# Altium schematic sheet MicroDial_Data_Log_V2_Part4.SchDoc: MicroDial_Data_Log_V2
size A4; Author: Burak DURU; Organization: CNRS DT INSU UPS855; Address1: 1, place Aristide Briand; Address2: 92195 Meudon Cedex; Address3: Tel : 01 45 07 50 50; Address4: FRANCE; DocumentNumber: 4; Revision: 2.0; SheetNumber: 4; SheetTotal: 4
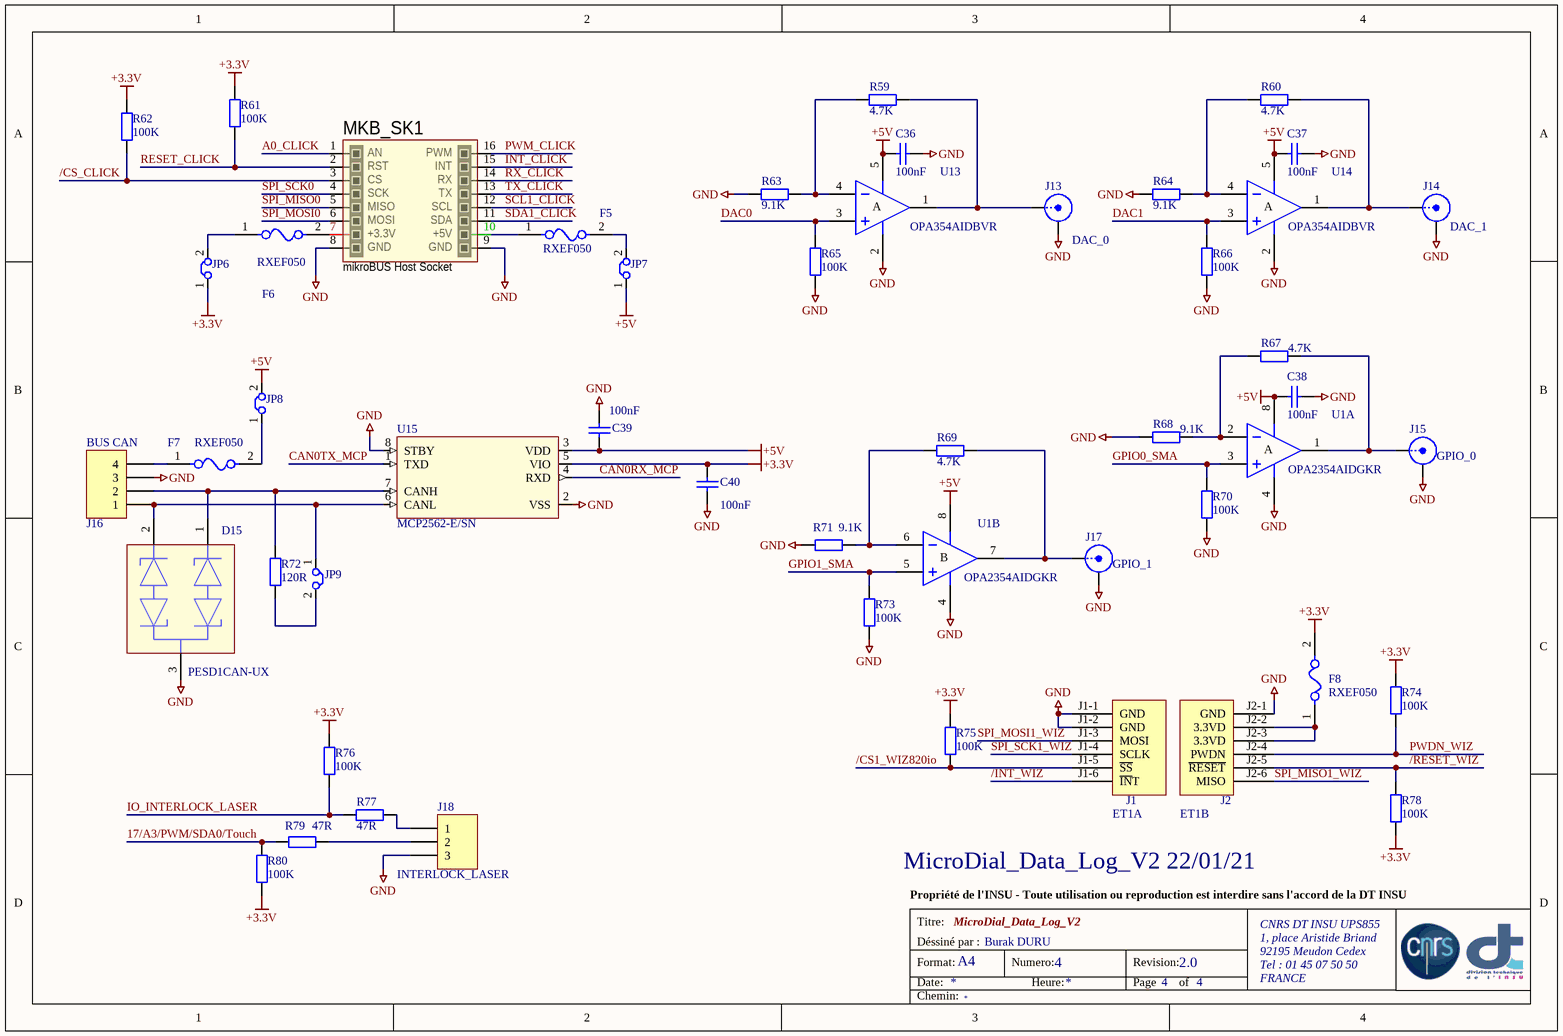
[diagram p0: MicroDial_Data_Log_V2_Part4.SchDoc]

## Parts
C36  value 100nF  [C603]  (hidden comment: Capacitor CMS)
C37  value 100nF  [C603]  (hidden comment: Capacitor CMS)
C38  value 100nF  [C603]  (hidden comment: Capacitor CMS)
C39  value 100nF  [C603]  (hidden comment: Capacitor CMS)
C40  value 100nF  [C603]  (hidden comment: Capacitor CMS)
D15  PESD1CAN-UX  [SOT323 (SC70) - PESD1CAN-UX]
ET1  Module ETHERNET WIZNET WIZ820IO  [WIZ820io-V1.0]  (value not drawn)  (parts A,B of 2)
F5  RXEF050  [FP-RXEF050-MFG]
F6  RXEF050  [FP-RXEF050-MFG]
F7  RXEF050  [FP-RXEF050-MFG]
F8  RXEF050  [FP-RXEF050-MFG]
J13  DAC_0  [SMB125B1]
J14  DAC_1  [SMB125B1]
J15  GPIO_0  [SMA R125.680.000]
J16  BUS CAN  [PHOENIX CONTACT MC 1,5/ 4-G-3,81 - 1803293]
J17  GPIO_1  [SMA R125.680.000]
J18  INTERLOCK_LASER  [Molex 90136-2203 - UPDATE]
JP6  Cavalier 1 Positions 1-2  [Molex 90120-0762]  (value not drawn)
JP7  Cavalier 1 Positions 1-2  [Molex 90120-0762]  (value not drawn)
JP8  Cavalier 1 Positions 1-2  [Molex 90120-0762]  (value not drawn)
JP9  Cavalier 1 Positions 1-2  [Molex 90120-0762]  (value not drawn)
MKB_SK1  mikroBUS Host Socket  [mikroBUS Host Socket]
R59  value 4.7K  [MMA204]  (hidden comment: Res)
R60  value 4.7K  [MMA204]  (hidden comment: Res)
R61  value 100K  [R603]  (hidden comment: Res)
R62  value 100K  [R603]  (hidden comment: Res)
R63  value 9.1K  [MMA204]  (hidden comment: Res)
R64  value 9.1K  [MMA204]  (hidden comment: Res)
R65  value 100K  [R603]  (hidden comment: Res)
R66  value 100K  [R603]  (hidden comment: Res)
R67  value 4.7K  [MMA204]  (hidden comment: Res)
R68  value 9.1K  [MMA204]  (hidden comment: Res)
R69  value 4.7K  [MMA204]  (hidden comment: Res)
R70  value 100K  [R603]  (hidden comment: Res)
R71  value 9.1K  [MMA204]  (hidden comment: Res)
R72  value 120R  [R603]  (hidden comment: Res)
R73  value 100K  [R603]  (hidden comment: Res)
R74  value 100K  [R603]  (hidden comment: Res)
R75  value 100K  [R603]  (hidden comment: Res)
R76  value 100K  [R603]  (hidden comment: Res)
R77  value 47R  [R603]  (hidden comment: Res)
R78  value 100K  [R603]  (hidden comment: Res)
R79  value 47R  [R603]  (hidden comment: Res)
R80  value 100K  [R603]  (hidden comment: Res)
U1  OPA2354AIDGKR  [VSSOP-8 (DGK(S-PDSO-G8))]  (parts A,B of 2)
U13  OPA354AIDBVR  [SOT23-5]
U14  OPA354AIDBVR  [SOT23-5]
U15  MCP2562-E/SN  [SOIC8N (Narrow) - MCP2562-E]

## Nets
+3.3V: C40.1 F8.2 JP6.1 R61.2 R62.2 R74.2 R75.2 R76.2 R78.2 R80.1 U15.5(VIO)
+5V: C36.1 C37.1 C38.1 C39.1 JP7.1 JP8.2 U1.8(V+) U13.5(V+) U14.5(V+) U15.3(VDD)
GND: C36.2 C37.2 C38.2 C39.2 C40.2 D15.3(common_cathode) ET1.J1-1(GND) ET1.J1-2(GND) ET1.J2-1(GND) J13.2(Y) J14.2(Y) J15.2(Y) J16.3 J17.2(Y) J18.3 MKB_SK1.8(GND) MKB_SK1.9(GND) R63.1 R64.1 R65.1 R66.1 R68.1 R70.1 R71.1 R73.1 U1.4(V-) U13.2(V-) U14.2(V-) U15.2(VSS) U15.8(STBY)
17/A3/PWM/SDA0/Touch: R79.1 R80.2
/CS1_WIZ820io: ET1.J1-5(~{SS}) R75.1
/CS_CLICK: MKB_SK1.3(CS) R62.1
/INT_WIZ: ET1.J1-6(~{IN}T)
/RESET_WIZ: ET1.J2-5(~{RESET}) R78.1
A0_CLICK: MKB_SK1.1(AN)
CAN0RX_MCP: U15.4(RXD)
CAN0TX_MCP: U15.1(TXD)
DAC0: R65.2 U13.3(IN+)
DAC1: R66.2 U14.3(IN+)
GPIO0_SMA: R70.2 U1.3(IN+)
GPIO1_SMA: R73.2 U1.5(IN+)
INT_CLICK: MKB_SK1.15(INT)
IO_INTERLOCK_LASER: R76.1 R77.1
PWDN_WIZ: ET1.J2-4(PWDN) R74.1
PWM_CLICK: MKB_SK1.16(PWM)
RESET_CLICK: MKB_SK1.2(RST) R61.1
RX_CLICK: MKB_SK1.14(RX)
SCL1_CLICK: MKB_SK1.12(SCL)
SDA1_CLICK: MKB_SK1.11(SDA)
SPI_MISO0: MKB_SK1.5(MISO)
SPI_MISO1_WIZ: ET1.J2-6(MISO)
SPI_MOSI0: MKB_SK1.6(MOSI)
SPI_MOSI1_WIZ: ET1.J1-3(MOSI)
SPI_SCK0: MKB_SK1.4(SCK)
SPI_SCK1_WIZ: ET1.J1-4(SCLK)
TX_CLICK: MKB_SK1.13(TX)
NetD15_1: D15.1(cathode_1) J16.2 R72.2 U15.7(CANH)
NetD15_2: D15.2(cathode_2) J16.1 JP9.1 U15.6(CANL)
NetET1_J2-2: ET1.J2-2(3.3VD) ET1.J2-3(3.3VD) F8.1
NetF5_1: F5.1 MKB_SK1.10(+5V)
NetF5_2: F5.2 JP7.2
NetF6_1: F6.1 JP6.2
NetF6_2: F6.2 MKB_SK1.7(+3.3V)
NetF7_1: F7.1 J16.4
NetF7_2: F7.2 JP8.1
NetJ13_1: J13.1(X) R59.2 U13.1(OUT)
NetJ14_1: J14.1(X) R60.2 U14.1(OUT)
NetJ15_1: J15.1(X) R67.2 U1.1(OUT)
NetJ17_1: J17.1(X) R69.2 U1.7(OUT)
NetJ18_1: J18.1 R77.2
NetJ18_2: J18.2 R79.2
NetJP9_2: JP9.2 R72.1
NetR59_1: R59.1 R63.2 U13.4(IN-)
NetR60_1: R60.1 R64.2 U14.4(IN-)
NetR67_1: R67.1 R68.2 U1.2(IN-)
NetR69_1: R69.1 R71.2 U1.6(IN-)

Not connected (* = marked no-connect by the designer): J13 3(REF) 4(REF) 5(REF); J14 3(REF) 4(REF) 5(REF); J15 3(REF) 4(REF) 5(REF); J17 3(REF) 4(REF) 5(REF)

## Notes on the sheet
- MicroDial_Data_Log_V2 22/01/21
- Propriété de l'INSU - Toute utilisation ou reproduction est interdire sans l'accord de la DT INSU
- Titre:
- Format:
- Date:
- Déssiné par :
- A4
- Numero:
- Heure:
- Revision:
- Page
- of
- Chemin:
- (in symbol OPA354AIDBVR) A
- (in symbol OPA2354AIDGKR, part A) A
- (in symbol OPA2354AIDGKR, part B) B
- (in symbol WIZ820IO, part A) J1
- (in symbol WIZ820IO, part B) J2

## Library data of the parts
C36-C40 = Cap: 06035C104JAT2A - Condensateur céramique multicouche CMS, 0603 [1608 Metric], 0.1 µF, 50 V, ± 5%, X7R; Code Commande: F174-0621
D15 = PESD1CAN-UX: Circuit de protection ESD, 50 V, SOT-323, 3 Broche(s), 150 W, PESD1 Series; Code Commande: F2357118; Value: PESD1CAN-UX
ET1 = WIZ820IO: IC MODULE W5200+MAG JACK Ethernet Contrôleur 10/100 Base-T/TX PHY SPI Interface Module WIZ820IO; Code Commande: Mouser 950-WIZ820IO + Digi-key  1278-1015-ND; Value: WIZNET WIZ820io
F5-F8 = RXEF050: RXEF050 -  Fusible PPTC réarmable, broches radiales, Série PolySwitch RXEF, 72 VDC, 500 mA, 1 A, 4 s, Rond; Code Commande: F117-5864; ComponentLink2Description: Datasheet; ComponentLink2URL: https://www.littelfuse.com/~/media/electronics/datasheets/resettable_ptcs/littelfuse_ptc_radial_leaded_rxef_datasheet.pdf.pdf; Value: RXEF050
J13 J14 = SMB1252B1-3GT30-50: Code Commande: F365-1241; Value: SMB1252B1-3GT30-50
J15 J17 = SMA RADIALL - R125680000: RADIALL - R125680000; Code Commande: F419-4810; Value: RADIALL - R125680000
J16 = PHOENIX CONTACT MC 1,5/ 4-G-3,81 - 1803293: Code Commande: F370-4749 / Digi-Key 277-1208-ND; Value: PHOENIX CONTACT MC 1,5/ 4-G-3,81 - 1803293
J18 = Molex 90136-2203: Molex 90136-2203 CGRID3 Simple Rangée Coudé 3V; Code Commande: RS670-5385; Value: Molex 90136-2203
JP6-JP9 = Jump 12: Jumper 2 Wire; Value: Molex 90120-0762; Code Commande: F973-3302
MKB_SK1 = mikroBUS Host Socket: mikroBUS Host Socket (Receptacle carte CLICK)
R59 R60 R67 R69 = Res: MMA02040E4701BB100 - Résistance CMS MELF, 4.7 kohm, Série MMA 0204, 200 V, Couche métallique, 250 mW, ± 0.1%; Code Commande: F308-6100
R61 R62 R65 R66 R70 R73-R76 R78 R80 = Res: CRGP0603F100K - Résistance à puce CMS, 100 kohm, ± 1%, 250 mW, 0603 [1608 Metric], Couche épaisse /; Code Commande: F286-1058
R63 R64 R68 R71 = Res: MMA02040E9101BB100 - Résistance CMS MELF, 9.1 kohm, Série MMA 0204, 200 V, Couche métallique, 250 mW, ± 0.1%; Code Commande: F308-6173
R72 = Res: CRGP0603F100K - Résistance à puce CMS, 100 kohm, ± 1%, 250 mW, 0603 [1608 Metric], Couche épaisse /; Code Commande: F348-2541
R77 R79 = Res: ERJ-UP3J470V - RES, 47R, 5%, 0.25W, 0603, THICK FILM; Code Commande: F348-2241
U1 = OPA2354AIDGKR: OPA2354AIDGKR Amplificateur opérationnel, Double, 2 amplificateurs, 350 kHz, 0.16 V/µs, 1.8V à 5.5V; Code Commande: F311-7463; Value: OPA2354AIDGKR
U13 U14 = OPA354AIDBVR: Amplificateur opérationnel, 1 amplificateur, 250 MHz, 150 V/µs, 2.5V à 5.5V, ± 1.25V à ± 2.75V; Code Commande: F311-7557 /Digikey 296-26279-1-ND; Value: OPA354AIDBVR
U15 = MCP2562-E/SN: MCP2562-E/SN Bus CAN, Émetteur-récepteur, CAN, LIN, 1, 1, 4.5 V, 5.5 V, SOIC; Code Commande: F236-2839; Value: MCP2562-E/SN